# Altium schematic sheet FPGA_Digilent_Spartan3_Board.SchDoc: Example for Digilent Spartan-3 Board
size B; Organization: Altium Limited; Address1: L3, 12a Rodborough Rd; Address2: Frenchs Forest; Address3: NSW; Address4: Australia 2086; DocumentNumber: 1; SheetNumber: 1; SheetTotal: 1
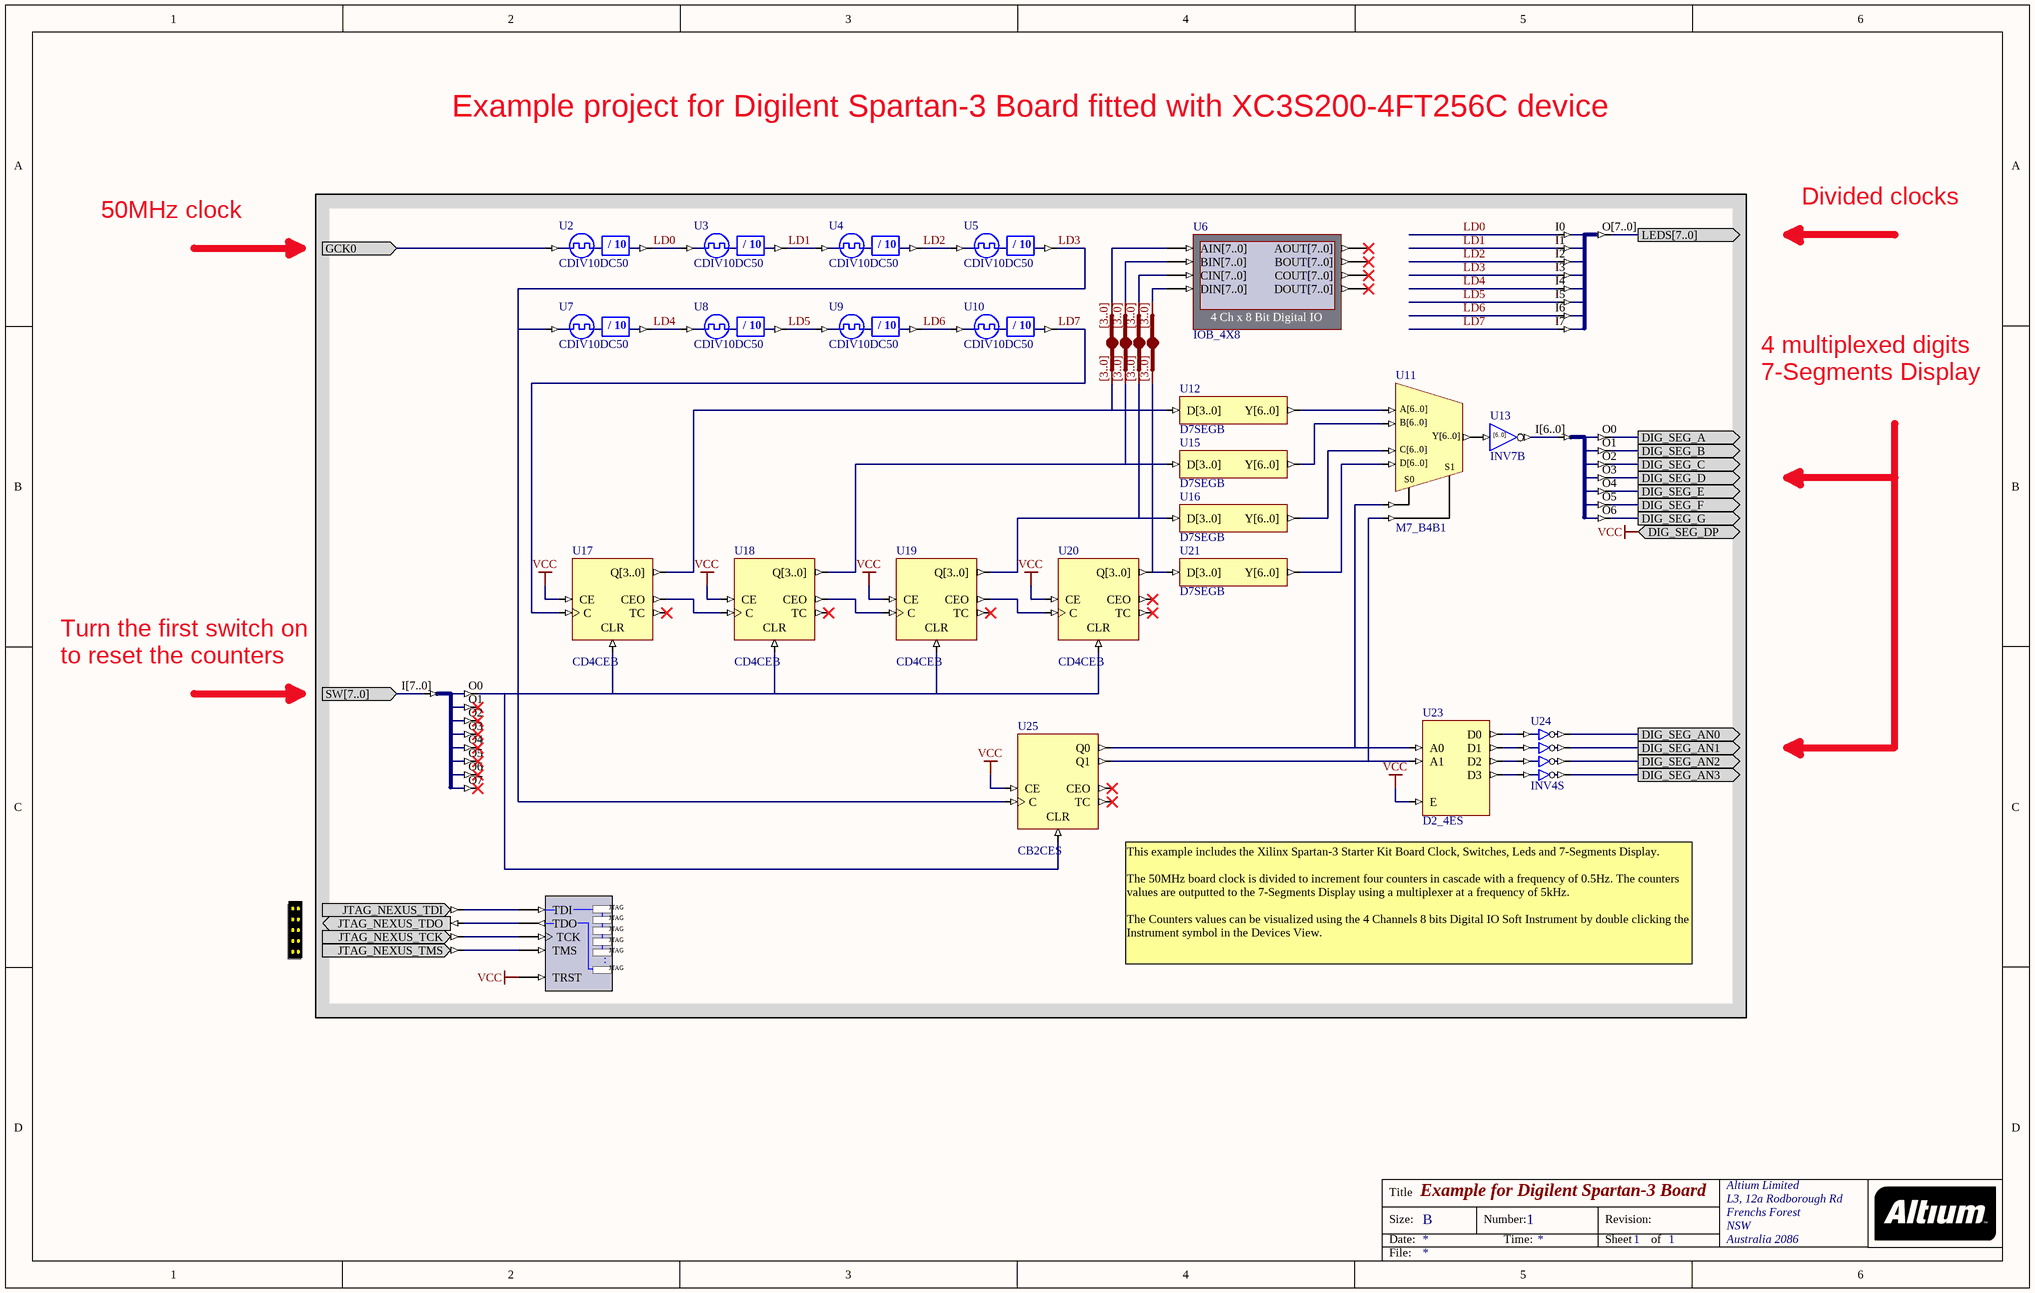
[diagram p0: FPGA_Digilent_Spartan3_Board.SchDoc]

## Parts
?  NEXUS_JTAG_CONNECTOR  (value not drawn)
JB_S1  IndexA: [3..0]  (hidden comment: JB)
JB_S2  IndexA: [3..0]  (hidden comment: JB)
JB_S3  IndexA: [3..0]  (hidden comment: JB)
JB_S4  IndexA: [3..0]  (hidden comment: JB)
NEXUS_JTAG_PORT  NEXUS_JTAG_PORT  (value not drawn)
U1  J8S_8B  (value not drawn)
U2  CDIV10DC50
U3  CDIV10DC50
U4  CDIV10DC50
U5  CDIV10DC50
U6  IOB_4X8
U7  CDIV10DC50
U8  CDIV10DC50
U9  CDIV10DC50
U10  CDIV10DC50
U11  M7_B4B1
U12  D7SEGB
U13  INV7B
U14  J7B_7S  (value not drawn)
U15  D7SEGB
U16  D7SEGB
U17  CD4CEB
U18  CD4CEB
U19  CD4CEB
U20  CD4CEB
U21  D7SEGB
U22  J8B_8S  (value not drawn)
U23  D2_4ES
U24  INV4S
U25  CB2CES

## Ports
DIG_SEG_A (out), DIG_SEG_AN0 (out), DIG_SEG_AN1 (out), DIG_SEG_AN2 (out), DIG_SEG_AN3 (out), DIG_SEG_B (out), DIG_SEG_C (out), DIG_SEG_D (out), DIG_SEG_DP (out), DIG_SEG_E (out), DIG_SEG_F (out), DIG_SEG_G (out), GCK0 (in), LEDS[7..0] (out), SW[7..0] (in)

## Nets
VCC: NEXUS_JTAG_PORT.TRST U17.CE U18.CE U19.CE U20.CE U23.E U25.CE ; port DIG_SEG_DP
DIG_SEG_A: U14.O0 ; port DIG_SEG_A
DIG_SEG_AN0: U24.O0 ; port DIG_SEG_AN0
DIG_SEG_AN1: U24.O1 ; port DIG_SEG_AN1
DIG_SEG_AN2: U24.O2 ; port DIG_SEG_AN2
DIG_SEG_AN3: U24.O3 ; port DIG_SEG_AN3
DIG_SEG_B: U14.O1 ; port DIG_SEG_B
DIG_SEG_C: U14.O2 ; port DIG_SEG_C
DIG_SEG_D: U14.O3 ; port DIG_SEG_D
DIG_SEG_E: U14.O4 ; port DIG_SEG_E
DIG_SEG_F: U14.O5 ; port DIG_SEG_F
DIG_SEG_G: U14.O6 ; port DIG_SEG_G
GCK0: U2.CLKIN ; port GCK0
LD0: U1.I0 U2.CLKDV U3.CLKIN
LD1: U1.I1 U3.CLKDV U4.CLKIN
LD2: U1.I2 U4.CLKDV U5.CLKIN
LD3: U1.I3 U5.CLKDV U7.CLKIN U25.C
LD4: U1.I4 U7.CLKDV U8.CLKIN
LD5: U1.I5 U8.CLKDV U9.CLKIN
LD6: U1.I6 U9.CLKDV U10.CLKIN
LD7: U1.I7 U10.CLKDV U17.C
LEDS[7..0]: U1.O[7..0] ; port LEDS[7..0]
SW[7..0]: U22.I[7..0] ; port SW[7..0]
Net?_JTAG_NEXUS_TCK: ?.JTAG_NEXUS_TCK NEXUS_JTAG_PORT.TCK
Net?_JTAG_NEXUS_TDI: ?.JTAG_NEXUS_TDI NEXUS_JTAG_PORT.TDI
Net?_JTAG_NEXUS_TDO: ?.JTAG_NEXUS_TDO NEXUS_JTAG_PORT.TDO
Net?_JTAG_NEXUS_TMS: ?.JTAG_NEXUS_TMS NEXUS_JTAG_PORT.TMS
NetJB_S1_A[0..0]: JB_S1.A[0..0] U12.D[3..0] U17.Q[3..0]
NetJB_S1_B[0..0]: JB_S1.B[0..0] U6.AIN[7..0]
NetJB_S2_A[0..0]: JB_S2.A[0..0] U15.D[3..0] U18.Q[3..0]
NetJB_S2_B[0..0]: JB_S2.B[0..0] U6.BIN[7..0]
NetJB_S3_A[0..0]: JB_S3.A[0..0] U16.D[3..0] U19.Q[3..0]
NetJB_S3_B[0..0]: JB_S3.B[0..0] U6.CIN[7..0]
NetJB_S4_A[0..0]: JB_S4.A[0..0] U20.Q[3..0] U21.D[3..0]
NetJB_S4_B[0..0]: JB_S4.B[0..0] U6.DIN[7..0]
NetU11_A[6..0]: U11.A[6..0] U12.Y[6..0]
NetU11_B[6..0]: U11.B[6..0] U15.Y[6..0]
NetU11_C[6..0]: U11.C[6..0] U16.Y[6..0]
NetU11_D[6..0]: U11.D[6..0] U21.Y[6..0]
NetU11_S0: U11.S0 U23.A0 U25.Q0
NetU11_S1: U11.S1 U23.A1 U25.Q1
NetU11_Y[6..0]: U11.Y[6..0] U13.I[6..0]
NetU13_O[6..0]: U13.O[6..0] U14.I[6..0]
NetU17_CEO: U17.CEO U18.C
NetU17_CLR: U17.CLR U18.CLR U19.CLR U20.CLR U22.O0 U25.CLR
NetU18_CEO: U18.CEO U19.C
NetU19_CEO: U19.CEO U20.C
NetU23_D0: U23.D0 U24.I0
NetU23_D1: U23.D1 U24.I1
NetU23_D2: U23.D2 U24.I2
NetU23_D3: U23.D3 U24.I3

Not connected (* = marked no-connect by the designer): U6 AOUT[7..0]* BOUT[7..0]* COUT[7..0]* DOUT[7..0]*; U17 TC*; U18 TC*; U19 TC*; U20 CEO* TC*; U22 O1* O2* O3* O4* O5* O6* O7*; U25 CEO* TC*

## Notes on the sheet
- Example project for Digilent Spartan-3 Board fitted with XC3S200-4FT256C device
- 50MHz clock
- Divided clocks
- 4 multiplexed digits 7-Segments Display
- Turn the first switch on to reset the counters
- This example includes the Xilinx Spartan-3 Starter Kit Board Clock, Switches, Leds and 7-Segments Display.
  The 50MHz board clock is divided to increment four counters in cascade with a frequency of 0.5Hz. The counters values are outputted to the 7-Segments Display using a multiplexer at a frequency of 5kHz.
  The Counters values can be visualized using the 4 Channels 8 bits Digital IO Soft Instrument by double clicking the Instrument symbol in the Devices View.
- Title
- Size:
- Date:
- B
- Number:
- Time:
- Revision:
- Sheet
- of
- File:
- (in symbol CDIV10DC50) / 10
- (in symbol INV7B) [6..0]
- (in symbol NEXUS_JTAG_PORT) .

## Library data of the parts
? = NEXUS_JTAG_CONNECTOR: JTAG Port; PortComponent: True; Published: 19-Nov-2003; Publisher: Altium Limited
JB_S1-JB_S4 = JB: System BUS Joiner; Published: 29-Jan-2004; Publisher: Altium Limited; LastRevisionNo: 1.00.00; HelpURL: CR0118 FPGA Generic Library Guide.pdf#page=296; FunctionalClass: Bus Joiner; IndexB: [3..0]
NEXUS_JTAG_PORT = NEXUS_JTAG_PORT: Soft Nexus-Chain Connector; NEXUS_JTAG_CONNECTOR: True; FunctionalClass: JTAG; Published: 29-Jan-2004; Publisher: Altium Limited; LastRevisionNo: 1.00.00; HelpURL: CR0118 FPGA Generic Library Guide.pdf#page=399
U1 = J8S_8B: 8 Single pin inputs to single 8-Bit output bus; FunctionalClass: Bus Joiner; PortSize: 8; ArchiveName: GENERIC; VHDLIB_SIM: GENERIC_LIB; Published: 29-Jan-2004; Publisher: Altium Limited; LastRevisionNo: 1.00.00; HelpURL: CR0118 FPGA Generic Library Guide.pdf#page=305
U2-U5 U7-U10 = CDIV10DC50: Clock Divider by 10 with 50% Duty Cycle Output; XilinxEquivalent: CLK_DIV10; DivisorRate: 10; DutyCycle: 50; ArchiveName: GENERIC; VHDLIB_SIM: GENERIC_LIB; Published: 29-Jan-2004; Publisher: Altium Limited; LastRevisionNo: 1.00.00; HelpURL: CR0118 FPGA Generic Library Guide.pdf#page=142; FunctionalClass: Clock Divider
U6 = IOB_4X8: 4 Ch x 8 Bit Digital IO; NEXUS_CORE: Instrument; NEXUS_JTAG_DEVICE: True; NEXUS_JTAG_ORDER: 0; Published: 30/09/2003; Publisher: Altium Hobart Technology Centre; Core Revision: 1.00.00
U11 = M7_B4B1: 4x7-Bit Bus to 1x7-Bit Bus Multiplexer; SubClass: BnB1; PortSize: 7; PortStyle: Bus Version; ArchiveName: GENERIC; VHDLIB_SIM: GENERIC_LIB; Published: 29-Jan-2004; Publisher: Altium Limited; LastRevisionNo: 1.00.00; HelpURL: CR0118 FPGA Generic Library Guide.pdf#page=368; FunctionalClass: Multiplexer
U12 U15 U16 U21 = D7SEGB: 7-Segment-Display Decoder for Common-Cathode LED (Active High Output), Bus Version; SubClass: 7SEG; PortSize: 7; ArchiveName: GENERIC; VHDLIB_SIM: GENERIC_LIB; Published: 29-Jan-2004; Publisher: Altium Limited; LastRevisionNo: 1.00.00; HelpURL: CR0118 FPGA Generic Library Guide.pdf#page=161; FunctionalClass: Decoder; PortStyle: Bus Version
U13 = INV7B: 7-Bit Inverter, Bus Version; FunctionalClass: Logic Primitive; SubClass: INV; PortSize: 7; ArchiveName: GENERIC; VHDLIB_SIM: GENERIC_LIB; Published: 29-Jan-2004; Publisher: Altium Limited; LastRevisionNo: 1.00.00; HelpURL: CR0118 FPGA Generic Library Guide.pdf#page=290; PortStyle: Bus Version
U14 = J7B_7S: 7-Bit input bus to 7 Single pin outputs; FunctionalClass: Bus Joiner; PortSize: 7; ArchiveName: GENERIC; VHDLIB_SIM: GENERIC_LIB; Published: 29-Jan-2004; Publisher: Altium Limited; LastRevisionNo: 1.00.00; HelpURL: CR0118 FPGA Generic Library Guide.pdf#page=303
U17-U20 = CD4CEB: Cascadable BCD Counter with Clock Enable and Asynchronous Clear, Bus Version; ClockTrigger: Rising; Enable: High; PortSize: 4; ArchiveName: GENERIC; VHDLIB_SIM: GENERIC_LIB; Published: 29-Jan-2004; Publisher: Altium Limited; LastRevisionNo: 1.00.00; HelpURL: CR0118 FPGA Generic Library Guide.pdf#page=137; FunctionalClass: Counter; SubClass: BCD; Reset: Asynchronous; PortType: Bus Version
U22 = J8B_8S: 8-Bit input bus to 8 single pin outputs; FunctionalClass: Bus Joiner; PortSize: 8; ArchiveName: GENERIC; VHDLIB_SIM: GENERIC_LIB; Published: 29-Jan-2004; Publisher: Altium Limited; LastRevisionNo: 1.00.00; HelpURL: CR0118 FPGA Generic Library Guide.pdf#page=303
U23 = D2_4ES: Binary 2- to 4-Bit Decoder with Enable, Single Pin Version; XilinxEquivalent: D2_4E; SubClass: n_m; Enable: High; PortSize: 4; ArchiveName: GENERIC; VHDLIB_SIM: GENERIC_LIB; Published: 29-Jan-2004; Publisher: Altium Limited; LastRevisionNo: 1.00.00; HelpURL: CR0118 FPGA Generic Library Guide.pdf#page=158; FunctionalClass: Decoder; PortStyle: Single Pin Version
U24 = INV4S: 4-Bit Inverter, Single Pin Version; XilinxEquivalent: INV4; FunctionalClass: Logic Primitive; SubClass: INV; PortSize: 4; ArchiveName: GENERIC; VHDLIB_SIM: GENERIC_LIB; Published: 29-Jan-2004; Publisher: Altium Limited; LastRevisionNo: 1.00.00; HelpURL: CR0118 FPGA Generic Library Guide.pdf#page=290; PortStyle: Single Pin Version
U25 = CB2CES: 2-Bit Cascadable Binary Counters with Clock Enable and Asynchronous Clear, Single Pin Version; XilinxEquivalent: CB2CE; ClockTrigger: Rising; Enable: High; PortSize: 2; ArchiveName: GENERIC; VHDLIB_SIM: GENERIC_LIB; Published: 29-Jan-2004; Publisher: Altium Limited; LastRevisionNo: 1.00.00; HelpURL: CR0118 FPGA Generic Library Guide.pdf#page=127; FunctionalClass: Counter; SubClass: Binary; Reset: Asynchronous; PortType: Single Pin Version